# Altium schematic sheet CAN_TJA1042-SchoDoc.SchDoc
size B; SheetNumber: 6; SheetTotal: 7
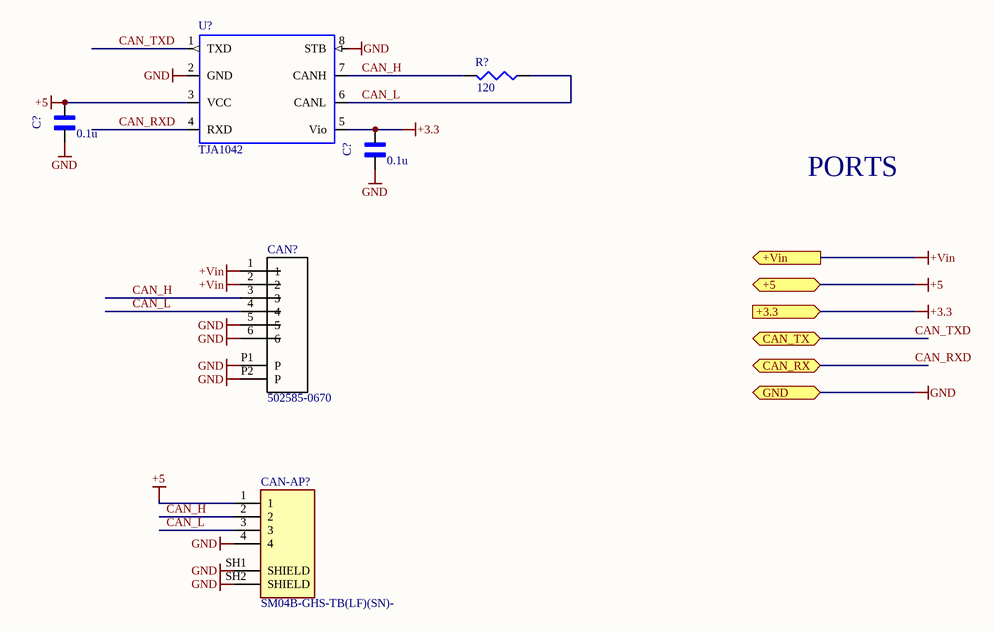
[diagram p0: CAN_TJA1042-SchoDoc.SchDoc]

## Parts
(Parts that share a designator on the sheet are numbered #1, #2 ... from top to bottom, then left to right.)
C?#1  value 0.1u  [*CAPC1608X90]  (hidden comment: GX035C104MAT2-500)
C?#2  value 0.1u  [*CAPC1608X90]  (hidden comment: GX035C104MAT2-500)
CAN-AP?  SM04B-GHS-TB(LF)(SN)-  [JST_SM04B-GHS-TB(LF)(SN)-]
CAN?  502585-0670  [MOLEX_502585-0670]
R?  value 120  [J1-0603]  (hidden comment: Res3)
U?  TJA1042  [SOT782-1]

## Ports
+3.3 (in), +5 (bidir), +Vin (out), CAN_RX (bidir), CAN_TX (bidir), GND (bidir)

## Nets
+3.3: C?#2.1 U?.5(Vio) ; port +3.3
+5: C?#1.1 CAN-AP?.1 U?.3(VCC) ; port +5
+Vin: CAN?.1 CAN?.2 ; port +Vin
GND: C?#1.2 C?#2.2 CAN-AP?.4 CAN-AP?.SH1(SHIELD) CAN-AP?.SH2(SHIELD) CAN?.5 CAN?.6 CAN?.P1(P) CAN?.P2(P) U?.2(GND) U?.8(STB) ; port GND
CAN_H: CAN-AP?.2 CAN?.3 R?.2 U?.7(CANH)
CAN_L: CAN-AP?.3 CAN?.4 R?.1 U?.6(CANL)
CAN_RXD: U?.4(RXD) ; port CAN_RX
CAN_TXD: U?.1(TXD) ; port CAN_TX

## Notes on the sheet
- PORTS

## Library data of the parts
C?#1 C?#2 = GX035C104MAT2-500: Cap Thin Film 0.1uf 50v 0603; MF: AVX; MP: GX035C104MAT2-500 or CL10B104JB8NNNC; Pacage Metric: 1608; Type: SMD; Package: 0603 AVX; SnapEDA_Link: https://www.snapeda.com/parts/GX035C104MAT2-500/AVX/view-part/?ref=snap
CAN-AP? = SM04B-GHS-TB(LF)(SN)-: Connector Header Surface Mount, Right Angle 4 position 0.049 _1.25mm_; MF: JST Sales; MP: SM04B-GHS-TB(LF)(SN); Package: None; Value: *; SnapEDA_Link: https://www.snapeda.com/parts/SM04B-GHS-TB%28LF%29%28SN%29-/JST%20Sales%20America%20Inc./view-part/2759740/?ref=snap; HelpURL: http://www.farnell.com/datasheets/2082975.pdf; System: Connector; ChipDip_Link: https://www.chipdip.ru/product/sm04b-ghs-tb-lf-sn-gh-1.25mm-header-side-ent
CAN? = 502585-0670: 1.50mm Pitch, CLIK-Mate PCB Receptacle, Single Row, Surface Mount, Right-Angle, Tin Plating, Positive Lock, 6 Circuits, Natural; MF: Molex; System: Connector; MP: 502585-0670; Package: None; SnapEDA_Link: https://www.snapeda.com/parts/502494-0670/Molex/view-part/?ref=snap; Value: *; Type: SMD
R? = Res3: 120 Ohms 1 0.1 W 1 10 W Chip Resistor 0603 1608 Metric Thick Film; Pacage Metric: 1608; MP: RC0603FR-07120RL; ChipDip_Link: https://www.chipdip.ru/product0/9000079618; HelpURL: https://www.chipdip.ru/product0/9000079618; Package: R0603; Type: SMD
U? = TJA1042: 1/1 Transceiver Half CANbus 8-SO; MF: NXP USA; SnapEDA_Link: https://www.snapeda.com/parts/TJA1042/NXP%20USA%20Inc./view-part/900919/?ref=snap; Value: *; MP: TJA1042; Package: VDFN-8 NXP USA; ChipDip_Link: https://www.chipdip.ru/product1/8002840332; HelpURL: https://static.chipdip.ru/lib/583/DOC001583059.pdf; Type: SMD